# EAGLE board Goldfish BigBoard 2- revisions after produced board (EAGLE 6.5.0), part 1 of 2
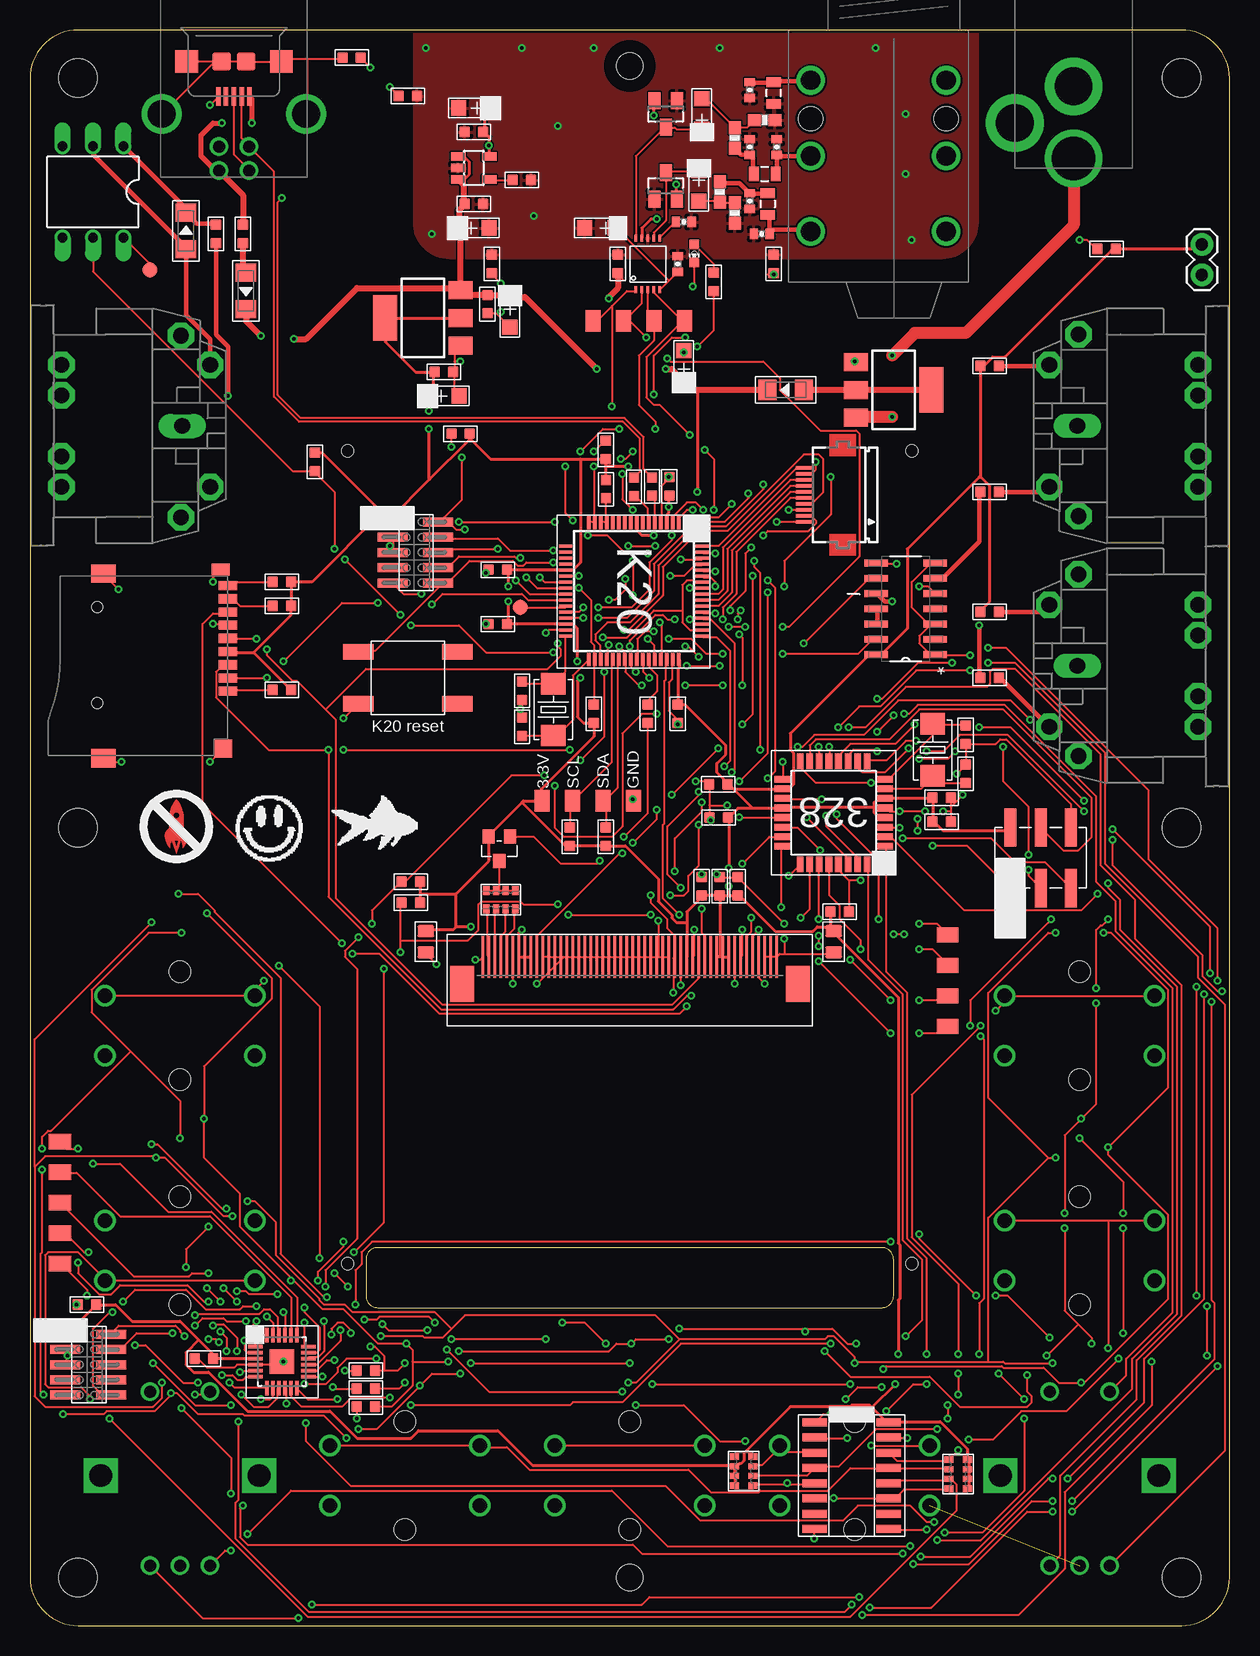
[diagram p3: board, top side]
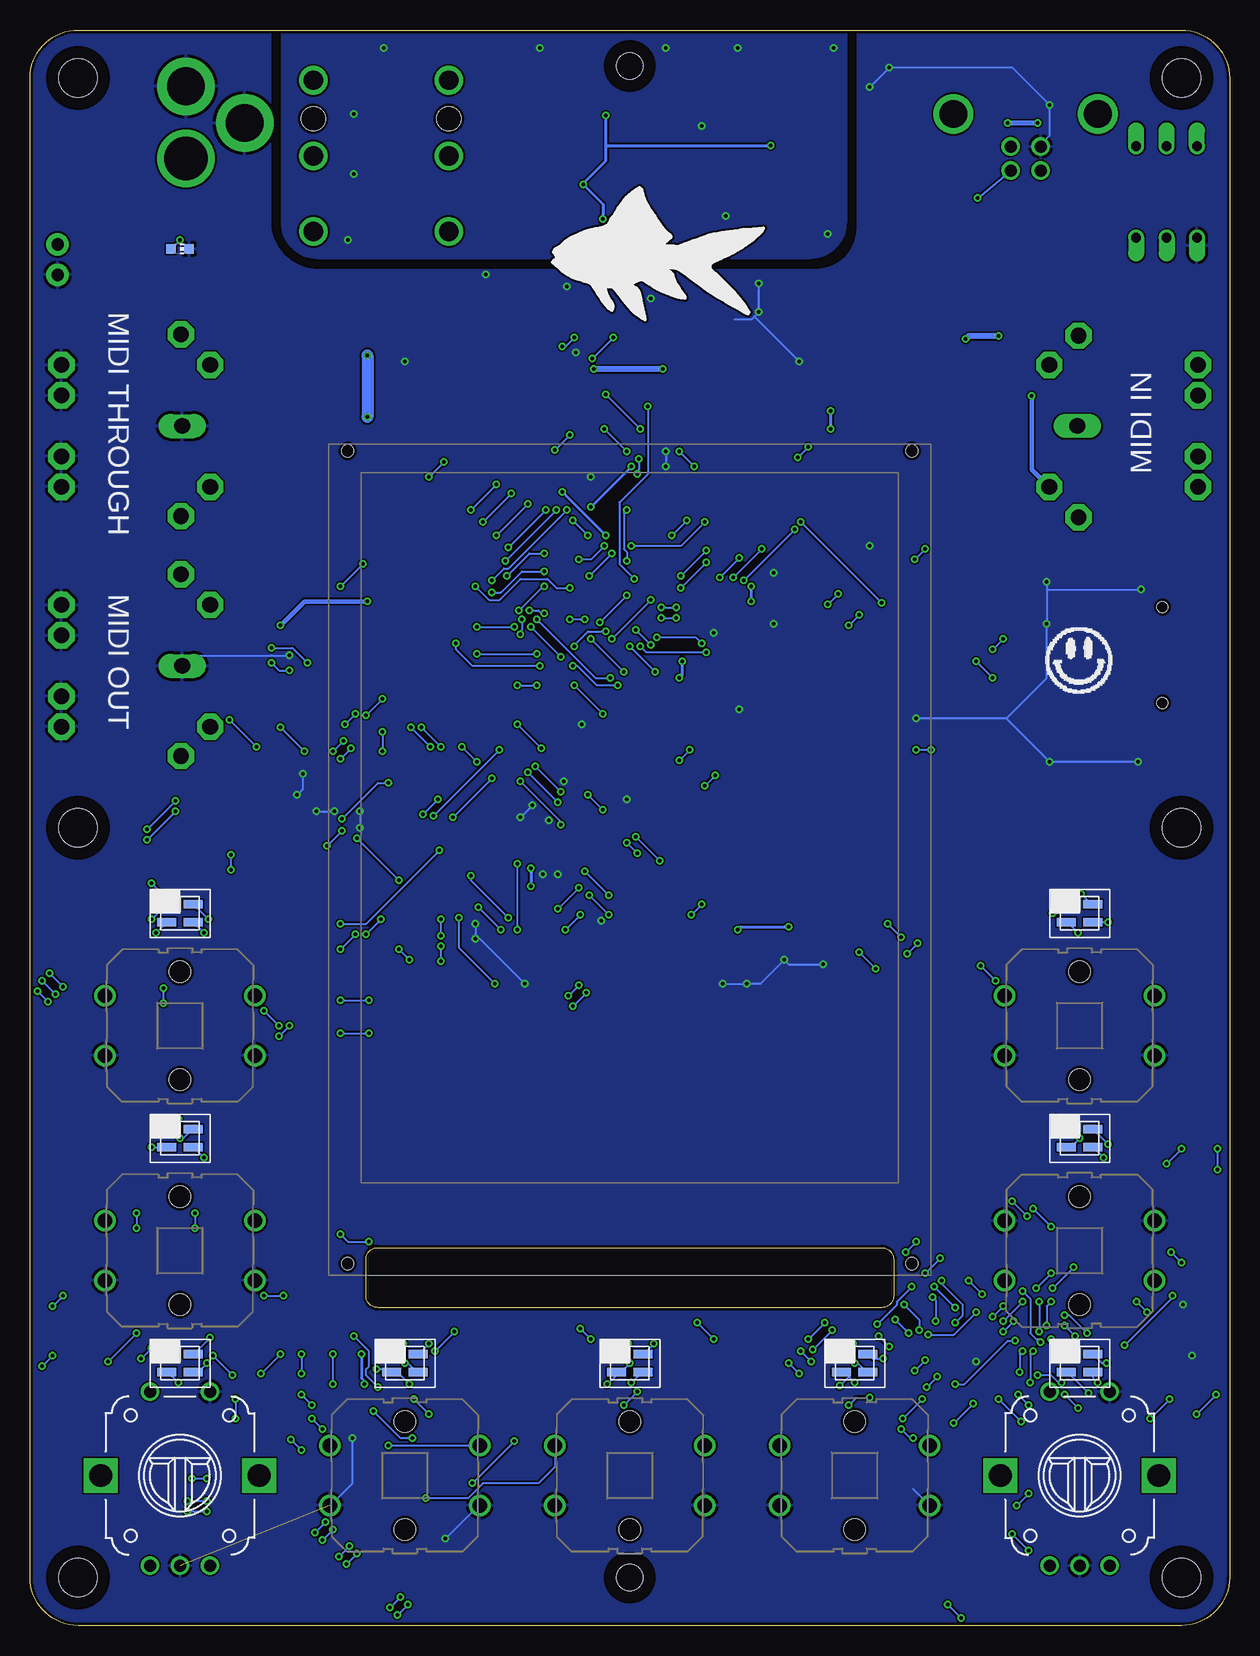
[diagram p4: board, bottom side, seen from below]

Size 100 x 133 mm. Coordinates in mm from the lower left corner, seen from the top.
Outline: 96,133 4,133 arc90 0,129 0,4 arc90 4,0 96,0 arc90 100,4 100,129 arc90 96,133
Outline: 72,27.5 72,30.5 arc90 71,31.5 29,31.5 arc90 28,30.5 28,27.5 arc90 29,26.5 71,26.5 arc90 72,27.5
Copper layers (1*16): Top 0.035mm / dielectric 1.5mm / Bottom 0.035mm
Design rules "ITEADstudio_DRC": minimum track width 6mil, minimum drill 12mil, track to track 6mil, track to pad 6mil, pad to pad 6mil, via to via 6mil, smd to smd 0mil, copper to edge 10mil, drill to drill 10mil, minimum pad ring 10mil, minimum via ring 6mil, stop-mask expansion 2mil, vias tented up to drill 100mil, thermal gap 10mil
Net classes: 1 GND: width 0.254 mm; 2 BIGAUDIO: width 1.016 mm; 3 MEDIUMAUDIO: width 0.381 mm; 4 INPUTPOWER: width 0.254 mm
Holes 0.4 mm at 55.38,114.38
tRestrict: area 41.9,18.8 to 48.5,18.9

## Footprints (pad centres in the part's own frame; a part is rotated, then mirrored left to right if it is on the bottom)
2X3_SMT_POSTS = smd 1 x 3.17: 1 -2.54,-2.54; 2 -2.54,2.54; 3 0,-2.54; 4 0,2.54; 5 2.54,-2.54; 6 2.54,2.54
4P-SMD-6.0X6.0X5.0H = smd 2.54 x 1.27: 1 -4.129,2.159; 2 -4.129,-2.159; 3 4.129,-2.159; 4 4.129,2.159
C0603 = smd 0.889 x 0.889: 1 -0.762,0; 2 0.762,0
AVX-A = smd 1.27 x 1.27: + -1.27,0; - 1.27,0
0402-CAP = smd 0.7 x 0.9: 1 -0.65,0; 2 0.65,0
C0805 = smd 1.016 x 1.397: 1 -0.889,0; 2 0.889,0
LL-34 = smd 1.524 x 1.676: A -1.524,0; C 1.524,0
SOT23 = smd 1 x 1.4: 1 -0.95,-1.1; 2 0.95,-1.1; 3 0,1.1
0805 = smd 0.8 x 1.2: 1 -0.9,0; 2 0.9,0
3.2-NOMARKINGS-SMALLSAFEZONE = hole 3.2: 0,0
MK20DX128VLH5 = smd 1.1 x 0.285: 1 -5.605,3.385; 2 -5.605,2.885; 3 -5.605,2.385; 4 -5.605,1.885; 5 -5.605,1.385; 6 -5.605,0.885; 7 -5.605,0.385; 8 -5.605,-0.115; 9 -5.605,-0.615; 10 -5.605,-1.115; 11 -5.605,-1.615; 12 -5.605,-2.115; 13 -5.605,-2.615; 14 -5.605,-3.115; 15 -5.605,-3.615; 16 -5.605,-4.115; 33 5.795,-4.115; 34 5.795,-3.615; 35 5.795,-3.115; 36 5.795,-2.615; 37 5.795,-2.115; 38 5.795,-1.615; 39 5.795,-1.115; 40 5.795,-0.615; 41 5.795,-0.115; 42 5.795,0.385; 43 5.795,0.885; 44 5.795,1.385; 45 5.795,1.885; 46 5.795,2.385; 47 5.795,2.885; 48 5.795,3.385 | smd 0.285 x 1.1: 17 -3.655,-6.065; 18 -3.155,-6.065; 19 -2.655,-6.065; 20 -2.155,-6.065; 21 -1.655,-6.065; 22 -1.155,-6.065; 23 -0.655,-6.065; 24 -0.155,-6.065; 25 0.345,-6.065; 26 0.845,-6.065; 27 1.345,-6.065; 28 1.845,-6.065; 29 2.345,-6.065; 30 2.845,-6.065; 31 3.345,-6.065; 32 3.845,-6.065; 49 3.845,5.335; 50 3.345,5.335; 51 2.845,5.335; 52 2.345,5.335; 53 1.845,5.335; 54 1.345,5.335; 55 0.845,5.335; 56 0.345,5.335; 57 -0.155,5.335; 58 -0.655,5.335; 59 -1.155,5.335; 60 -1.655,5.335; 61 -2.155,5.335; 62 -2.655,5.335; 63 -3.155,5.335; 64 -3.655,5.335
SOT223 = smd 1.5 x 2: 1 -2.3,-3.15; 2 0,-3.15; 3 2.3,-3.15 | smd 3.8 x 2: 4 0,3.15
SO16 = smd 0.66 x 2.032: 1 -4.445,-3.073; 2 -3.175,-3.073; 3 -1.905,-3.073; 4 -0.635,-3.073; 5 0.635,-3.073; 6 1.905,-3.073; 7 3.175,-3.073; 8 4.445,-3.073; 9 4.445,3.073; 10 3.175,3.073; 11 1.905,3.073; 12 0.635,3.073; 13 -0.635,3.073; 14 -1.905,3.073; 15 -3.175,3.073; 16 -4.445,3.073
SOT23-5 = smd 0.69 x 1.2: 1 -0.95,-1.3; 2 0,-1.3; 3 0.95,-1.3; 4 0.95,1.3; 5 -0.95,1.3
DIL06 = drill 0.813 offset: 1 -2.54,-3.81; 2 0,-3.81; 3 2.54,-3.81; 4 2.54,3.81; 5 0,3.81; 6 -2.54,3.81
9P-SMD-W-RING = smd 1.524 x 0.762: 1 -7.493,2.114; 2 -7.493,1.014; 3 -7.493,-0.086; 4 -7.493,-1.186; 5 -7.493,-2.286; 6 -7.493,-3.386; 7 -7.493,-4.486; 8 -7.493,-5.586; 9 -7.493,-6.686 | smd 1.524 x 1.016: G1 -6.893,-8.032 | smd 2.032 x 1.524: G2 2.88,-7.686; G3 2.88,7.714 | smd 1.524 x 1.524: G4 -7.101,6.895 | hole 0.889: 3.407,-4.886; 3.407,3.114
B-SMD-5P = smd 0.38 x 1.52: 1 -1.3,2.54; 2 -0.65,2.54; 3 0,2.54; 4 0.65,2.54; 5 1.3,2.54 | smd 1.524 x 1.524: E1 -1.016,-0.381; E2 1.016,-0.381 | smd 1.9 x 1.9: P1 -3.95,-0.381; P2 3.95,-0.381
AUDIO-JACK-.25-INCH-HORIZ-PTH = drill 1.6: P$2 4.2,-6.92; P$3 4.2,4.38; P$4 10.5,-6.92; P$5 10.5,4.38; P$6 16.8,-6.92; P$7 16.8,4.38 | hole 2: 7.4,4.38; 7.4,-6.92
1X02 = drill 1.016 pad 1.88: 1 0,0; 2 2.54,0
L0603 = smd 0.889 x 0.889: 1 -0.762,0; 2 0.762,0
CHIP-LED0603 = smd 0.8 x 0.8: A 0,-0.75; C 0,0.75
CP-2350 = drill 1.321 pad 2.184 octagon: 1 7.62,12.58; 3 -7.52,12.58; 4 5.08,15.02; 5 -5.08,15.02; PE -2.54,2.62; PE1 -5.08,2.62; PE2 5.08,2.62; PE@ 2.54,2.62 | drill 1.321 long: 2 0,12.68
R0603 = smd 0.889 x 0.889: 1 -0.762,0; 2 0.762,0
R1206-8 = smd 0.508 x 0.762: 1 -1.206,-0.762; 2 -0.381,-0.762; 3 0.381,-0.762; 4 1.206,-0.762; 5 1.206,0.762; 6 0.381,0.762; 7 -0.381,0.762; 8 -1.206,0.762
0603-RES = smd 1.1 x 1: 1 -0.85,0; 2 0.85,0
B3F-40XX-ROUND = drill 1.194: 1 -6.248,2.489; 2 6.248,2.489; 3 -6.248,-2.489; 4 6.248,-2.489 | hole 1.803: 0,-4.496; 0,4.496
PEC12_INCREMENTAL_ENCODER = drill 1: A -2.5,-7.5; B 2.5,-7.5; C 0,-7.5; P1 -2.5,7; P2 2.5,7 | drill 1.9 square: GND@1 -6.6,0; GND@2 6.6,0
M50-3600542 = smd 0.75 x 2.5: 1 -2.54,-1.81; 2 -2.54,2; 3 -1.27,-1.81; 4 -1.27,2; 5 0,-1.81; 6 0,2; 7 1.27,-1.81; 8 1.27,2; 9 2.54,-1.81; 10 2.54,2
PAD.03X.05 = smd 1.27 x 1.27: P$1 0,0
SOIC127P600X175-14N = smd 1.981 x 0.559: 1 -2.464,3.81; 2 -2.464,2.54; 3 -2.464,1.27; 4 -2.464,0; 5 -2.464,-1.27; 6 -2.464,-2.54; 7 -2.464,-3.81; 8 2.464,-3.81; 9 2.464,-2.54; 10 2.464,-1.27; 11 2.464,0; 12 2.464,1.27; 13 2.464,2.54; 14 2.464,3.81
TQFP32 = smd 1.27 x 0.559: 1 -4.293,2.8; 2 -4.293,2; 3 -4.293,1.2; 4 -4.293,0.4; 5 -4.293,-0.4; 6 -4.293,-1.2; 7 -4.293,-2; 8 -4.293,-2.8; 17 4.293,-2.8; 18 4.293,-2; 19 4.293,-1.2; 20 4.293,-0.4; 21 4.293,0.4; 22 4.293,1.2; 23 4.293,2; 24 4.293,2.8 | smd 0.559 x 1.27: 9 -2.8,-4.293; 10 -2,-4.293; 11 -1.2,-4.293; 12 -0.4,-4.293; 13 0.4,-4.293; 14 1.2,-4.293; 15 2,-4.293; 16 2.8,-4.293; 25 2.8,4.293; 26 2,4.293; 27 1.2,4.293; 28 0.4,4.293; 29 -0.4,4.293; 30 -1.2,4.293; 31 -2,4.293; 32 -2.8,4.293
SOT23' = smd 1.016 x 1.143: 1 -0.889,-1.016; 2 0.889,-1.016; 3 0,1.016
QFN50P400X400X100-25N = smd 1.2 x 0.3: 1 -2.2,1.245; 2 -2.2,0.762; 3 -2.2,0.254; 4 -2.2,-0.254; 5 -2.2,-0.762; 6 -2.2,-1.245; 13 2.2,-1.245; 14 2.2,-0.762; 15 2.2,-0.254; 16 2.2,0.254; 17 2.2,0.762; 18 2.2,1.245 | smd 0.3 x 1.2: 7 -1.245,-2.2; 8 -0.762,-2.2; 9 -0.254,-2.2; 10 0.254,-2.2; 11 0.762,-2.2; 12 1.245,-2.2; 19 1.245,2.2; 20 0.762,2.2; 21 0.254,2.2; 22 -0.254,2.2 | smd 0.305 x 1.2: 23 -0.762,2.2; 24 -1.245,2.2 | smd 2.032 x 2.032: 25 0,0
2.8"TFT = smd 0.2 x 3.5: 1 -12.25,-10.75; 2 -11.75,-10.75; 3 -11.25,-10.75; 4 -10.75,-10.75; 5 -10.25,-10.75; 6 -9.75,-10.75; 7 -9.25,-10.75; 8 -8.75,-10.75; 9 -8.25,-10.75; 10 -7.75,-10.75; 11 -7.25,-10.75; 12 -6.75,-10.75; 13 -6.25,-10.75; 14 -5.75,-10.75; 15 -5.25,-10.75; 16 -4.75,-10.75; 17 -4.25,-10.75; 18 -3.75,-10.75; 19 -3.25,-10.75; 20 -2.75,-10.75; 21 -2.25,-10.75; 22 -1.75,-10.75; 23 -1.25,-10.75; 24 -0.75,-10.75; 25 -0.25,-10.75; 26 0.25,-10.75; 27 0.75,-10.75; 28 1.25,-10.75; 29 1.75,-10.75; 30 2.25,-10.75; 31 2.75,-10.75; 32 3.25,-10.75; 33 3.75,-10.75; 34 4.25,-10.75; 35 4.75,-10.75; 36 5.25,-10.75; 37 5.75,-10.75; 38 6.25,-10.75; 39 6.75,-10.75; 40 7.25,-10.75; 41 7.75,-10.75; 42 8.25,-10.75; 43 8.75,-10.75; 44 9.25,-10.75; 45 9.75,-10.75; 46 10.25,-10.75; 47 10.75,-10.75; 48 11.25,-10.75; 49 11.75,-10.75; 50 12.25,-10.75 | smd 2 x 3: 51 -14,-13; 52 14,-13 | hole 1: -23.52,31.42; 23.52,31.42; 23.52,-36.33; -23.52,-36.33
2.2-NOMARKINGS-SMALLSAFEZONE = hole 2.2: 0,0
TSSOP-10 = smd 0.6 x 0.2: 1 -2.15,1; 2 -2.15,0.5; 3 -2.15,0; 4 -2.15,-0.5; 5 -2.15,-1; 6 2.15,-1; 7 2.15,-0.5; 8 2.15,0; 9 2.15,0.5; 10 2.15,1
163-179PH-EX = drill 3.16 pad 4.8: RING 0,-7.7; RING_SW -4.9,-10.75 | drill 3.64 pad 4.8: TIP 0,-13.7
3.5X2.8_RGB_LED = smd 1.6 x 0.7: ANODE 1.1,0.75; B 1.1,-0.75; G -1.1,-0.75; R -1.1,0.75
M05 = smd 1.27 x 1.905: P$1 -5.08,0; P$2 -2.54,0; P$3 0,0; P$4 2.54,0; P$5 5.08,0
M04 = smd 1.27 x 1.778: P$1 -3.81,0; P$2 -1.27,0; P$3 1.27,0; P$4 3.81,0
FCI61729 = drill 1: 1 1.25,4.71; 2 -1.25,4.71; 3 -1.25,2.71; 4 1.25,2.71 | drill 2.3: P$1 -6.02,0; P$2 6.02,0
2P-SMD-5.0X3.2 = smd 1.778 x 2.032: 1 -2.159,0; 2 2.159,0
FH12-10S-0.5SH = smd 0.3 x 1.3: 1 -2.25,3.25; 2 -1.75,3.25; 3 -1.25,3.25; 4 -0.75,3.25; 5 -0.25,3.25; 6 0.25,3.25; 7 0.75,3.25; 8 1.25,3.25; 9 1.75,3.25; 10 2.25,3.25

## Placement (x,y rotation side)
AVR_ISP  AVR_ISP  [2X3_SMT_POSTS]  84.25,64 0 top
BUTTON1  BUTTON-4P-3100010P1  [4P-SMD-6.0X6.0X5.0H]  31.5,79 0 top
C1  100nF  [C0603]  53.3,94.95 270 top
C2  100nF  [C0603]  39,83.47 0 top
C3  100nF  [C0603]  39.01,88.01 0 top
C4  100nF  [C0603]  4.75,26.75 0 top
C5  10uF  [AVX-A]  54.5,105 90 top
C6  100nF  [C0603]  76,69 180 top
C7  1000pF  [0402-CAP]  60,128 270 top
C8  100nF  [C0603]  76,67 180 top
C9  1uF  [C0603]  14.5,22.25 0 top
C10  1000pF  [0402-CAP]  62.25,123.25 90 top
C11  3.3uF  [AVX-A]  56,126 90 top
C12  3.3uF  [AVX-A]  55.75,120 270 top
C13  3.3uF  [AVX-A]  47.5,116.5 180 top
C15  10uF  [AVX-A]  34.5,102.5 0 top
C16  10uF  [AVX-A]  40,109.5 270 top
C17  100nF  [C0603]  38.13,110.14 90 top
C18  100nF  [C0603]  34.5,104.5 180 top
C19  10uF  [AVX-A]  37,126.5 180 top
C20  10uF  [AVX-A]  37,116.5 0 top
C23  22pF  [C0603]  41.03,77.92 90 top
C24  22pF  [C0603]  41.02,74.91 270 top
C25  100nF  [C0603]  54,76 90 top
C29  100nF  [C0603]  37,118.5 180 top
C30  100nF  [C0603]  37,124.5 0 top
C32  100nF  [C0603]  41,120.5 180 top
C33  100nF  [C0603]  59,61.62 270 top
C34  100nF  [C0603]  57.5,61.62 270 top
C35  10uF  [C0603]  56,61.62 270 top
C36  10uF  [C0805]  67,57 90 top
C37  100nF  [C0805]  33,57 90 top
C38  22pF  [C0603]  78,71 270 top
C39  22pF  [C0603]  78,74.25 90 top
C40  100nF  [C0603]  57.42,67.35 0 top
C41  100nF  [C0603]  57.38,70.12 0 top
C42  100nF  [C0603]  48,98 270 top
C43  1000pF  [0402-CAP]  61,116 180 top
C44  2700pF  [0402-CAP]  60,123.25 270 top
C45  2700pF  [0402-CAP]  60,118.75 90 top
C49  .1uF  [0402-CAP]  54,113.5 90 top
C50  10uF  [0402-CAP]  54.5,117 0 top
D1  [LL-34]  13,116.25 90 top
D2  BAT54S  [SOT23]  53,120 0 top
D3  BAT54S  [SOT23]  53,126 180 top
D4  [LL-34]  63,103 180 top
D5  [LL-34]  18,111.25 270 top
FB1  220  [0805]  61.5,118.5 270 top
FB2  220  [0805]  61.25,121 0 top
FB3  220  [0805]  62,127.75 90 top
H1  MOUNT-HOLE  [3.2-NOMARKINGS-SMALLSAFEZONE]  4,4 0 top
H2  MOUNT-HOLE  [3.2-NOMARKINGS-SMALLSAFEZONE]  96,4 0 top
H3  MOUNT-HOLE  [3.2-NOMARKINGS-SMALLSAFEZONE]  4,129 0 top
H4  MOUNT-HOLE  [3.2-NOMARKINGS-SMALLSAFEZONE]  96,129 0 top
H5  MOUNT-HOLE  [3.2-NOMARKINGS-SMALLSAFEZONE]  4,66.5 0 top
H6  MOUNT-HOLE  [3.2-NOMARKINGS-SMALLSAFEZONE]  96,66.5 0 top
IC1  MK20DX128VLH5  [MK20DX128VLH5]  50.7,86.32 270 top
IC2  LD1117AS33TR  [SOT223]  32.75,109 90 top
IC3  74HC165D  [SO16]  68.5,12.5 270 top
IC4  MIC5205-3.3YM5-1300180P1  [SOT23-5]  37,121.5 270 top
IC5  4N37  [DIL06]  5.25,119.5 180 top
IC6  LD1117AS50TR  [SOT223]  72,103 270 top
J1  MICRO-SDCARD-CONNECTOR-3300060P1  [9P-SMD-W-RING]  9,80 180 top
J2  MICRO-USB-5P-340015001  [B-SMD-5P]  17,130 180 top
JP1  [AUDIO-JACK-.25-INCH-HORIZ-PTH]  72,133 270 top
JP6  M02PTH  [1X02]  97.7,115.12 270 top
L1  FERRITE  [L0603]  26.82,130.71 180 top
L2  FB  [L0603]  48.02,94.72 90 top
L3  FB  [L0603]  49,113.5 270 top
L4  FERRITE  [L0603]  17.75,116 270 top
L5  FB  [L0603]  62,113.5 270 top
L6  FB  [L0603]  31.5,127.5 180 top
L7  FB  [L0603]  38.5,113.5 270 top
LED_EYE  YELLOW  [CHIP-LED0603]  55.38,114.38 180 top
LED_PWR  YELLOW  [CHIP-LED0603]  87.5,114.75 270 bottom
PORT_MIDI-IN  MIDIJACK  [CP-2350]  0,100 270 top
PORT_MIDI-OUT  MIDIJACK  [CP-2350]  100,80 90 top
PORT_MIDI-THROUGH  MIDIJACK  [CP-2350]  100,100 90 top
R1  2k  [R0603]  45,65.75 270 top
R2  22  [R0603]  28,18.25 180 top
R3  22  [R0603]  28,19.75 180 top
R4  10k  [R1206-8]  59.5,12.88 90 top
R5  10k  [R0603]  21,78 0 top
R6  22  [R0603]  28,21.25 180 top
R7  10k  [R0603]  21,85 0 top
R8  10k  [R0603]  35.89,99.34 0 top
R9  10k  [R0603]  67.5,59.5 180 top
R10  56  [R0603]  80,79 180 top
R11  56  [R0603]  80,84.5 0 top
R12  470  [0603-RES]  57.5,119.5 90 top
R13  470  [0603-RES]  58.75,124 270 top
R14  1k  [R0603]  89.75,114.75 0 top
R15  10k  [0603-RES]  61.25,125.5 180 top
R16  10k  [0603-RES]  58.75,117.75 90 top
R17  10k  [R0603]  47,76 90 top
R18  2k  [R0603]  48,65.75 270 top
R19  10k  [R0603]  51.5,76 90 top
R20  1k  [R0603]  57,112 270 top
R21  56  [R0603]  80,94.5 180 top
R22  56  [R0603]  80,105 0 top
R23  10k  [R1206-8]  77.38,12.62 270 top
R24  10k  [R0603]  21,87 0 top
R25  10k  [R1206-8]  39.25,60.5 180 top
R26  2k  [R0603]  31.75,62 180 top
R27  2k  [R0603]  31.75,60.25 180 top
R31  33  [R0603]  50.34,94.92 270 top
R32  33  [R0603]  51.86,94.94 270 top
R37  1k  [R0603]  23.75,97 90 top
R38  220  [R0603]  15.5,116 270 top
S1  [B3F-40XX-ROUND]  50,12.5 0 bottom
S2  [B3F-40XX-ROUND]  12.5,31.25 180 bottom
S3  [B3F-40XX-ROUND]  31.25,12.5 0 bottom
S4  [B3F-40XX-ROUND]  87.5,31.25 0 bottom
S5  [B3F-40XX-ROUND]  68.75,12.5 0 bottom
S6  [B3F-40XX-ROUND]  87.5,50 0 bottom
S7  [B3F-40XX-ROUND]  12.5,50 0 bottom
SW1  ENCODER_SW1-PEC12  [PEC12_INCREMENTAL_ENCODER]  12.5,12.5 0 bottom
SW2  ENCODER_SW1-PEC12  [PEC12_INCREMENTAL_ENCODER]  87.5,12.5 0 bottom
SWD1  CORTEX_SWD  [M50-3600542]  32.02,89.45 270 top
SWD2  CORTEX_SWD  [M50-3600542]  4.75,21.75 270 top
TP1  TEST-POINT3X5  [PAD.03X.05]  40.88,84.88 0 top
TP2  TEST-POINT3X5  [PAD.03X.05]  10,113 0 top
U1  CD74HC04M  [SOIC127P600X175-14N]  73,84.75 180 top
U2  ATMEGA328P-AU-1030060P1  [TQFP32]  67,67.75 180 top
U3  generic_pnp  [SOT23']  39.12,64.75 180 top
U4  MKL02Z32VFK4  [QFN50P400X400X100-25N]  21,22 0 top
U$1  2.8"TFT2.8"TFT  [2.8"TFT]  50,66.5 0 top
U$2  [2.2-NOMARKINGS-SMALLSAFEZONE]  50,130 0 top
U$3  FISH2CM_SILK  [FISH_WITHSILK]  49.12,113.62 0 bottom
U$4  FISH_SMALL  [FISH_SMALL]  30.5,66.75 0 top
U$5  [2.2-NOMARKINGS-SMALLSAFEZONE]  50,4 0 top
U$6  CS4344-DAC  [TSSOP-10]  51.5,113.5 90 top
U$7  2.1MMJACKTHM  [163-179PH-EX]  87,136 0 top
U$8  SMALLROCKET  [SMALLROCKET]  11.9,66.3 0 top
U$9  RGBLED_COMMONANODE  [3.5X2.8_RGB_LED]  31.25,21.88 0 bottom
U$10  RGBLED_COMMONANODE  [3.5X2.8_RGB_LED]  12.5,21.88 0 bottom
U$11  M05  [M05]  2.5,35.25 90 top
U$12  RGBLED_COMMONANODE  [3.5X2.8_RGB_LED]  87.5,59.38 0 bottom
U$13  RGBLED_COMMONANODE  [3.5X2.8_RGB_LED]  50,21.88 0 bottom
U$14  RGBLED_COMMONANODE  [3.5X2.8_RGB_LED]  12.5,40.62 0 bottom
U$15  RGBLED_COMMONANODE  [3.5X2.8_RGB_LED]  87.5,40.62 0 bottom
U$16  RGBLED_COMMONANODE  [3.5X2.8_RGB_LED]  68.75,21.88 0 bottom
U$17  RGBLED_COMMONANODE  [3.5X2.8_RGB_LED]  87.5,21.88 0 bottom
U$18  RGBLED_COMMONANODE  [3.5X2.8_RGB_LED]  12.5,59.38 0 bottom
U$19  [ACIDSMILE]  20,66.5 0 top
U$20  M04  [M04]  76.5,53.75 90 top
U$21  M04  [M04]  50.75,108.75 180 top
U$22  M04  [M04]  46.5,68.75 0 top
U$23  [ACIDSMILE]  12.5,80.5 0 bottom
X1  USB-B-FEMALE  [FCI61729]  17,126 180 top
X2  CRYSTAL-0500290P1  [2P-SMD-5.0X3.2]  43.63,76.35 90 top
X3  CRYSTAL-0500290P1  [2P-SMD-5.0X3.2]  75.25,73 270 top
X4  FH12-10S-0.5SH  [FH12-10S-0.5SH]  67.75,94.25 90 top